# Altium schematic sheet CURRENT_SENSE.SchDoc
size A; SheetNumber: 3; SheetTotal: 9
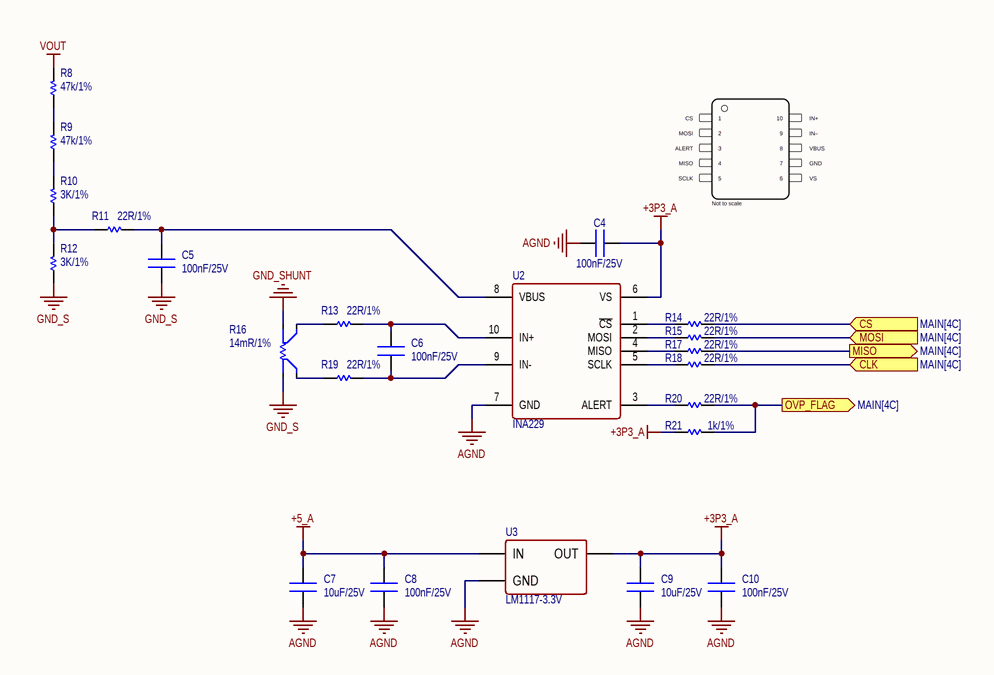
[diagram p0: CURRENT_SENSE.SchDoc]

## Parts
C4  100nF/25V  [CN-SMD-0603]
C5  100nF/25V  [CN-SMD-0603]
C6  100nF/25V  [CN-SMD-0603]
C7  10uF/25V  [CN-SMD-0603]
C8  100nF/25V  [CN-SMD-0603]
C9  10uF/25V  [CN-SMD-0603]
C10  100nF/25V  [CN-SMD-0603]
R8  47k/1%  [RES-SMD-0603]
R9  47k/1%  [RES-SMD-0603]
R10  3K/1%  [RES-SMD-0603]
R11  22R/1%  [RES-SMD-0603]
R12  3K/1%  [RES-SMD-0603]
R13  22R/1%  [RES-SMD-0603]
R14  22R/1%  [RES-SMD-0603]
R15  22R/1%  [RES-SMD-0603]
R16  14mR/1%  [RES-SMD-2010-SHUNT]
R17  22R/1%  [RES-SMD-0603]
R18  22R/1%  [RES-SMD-0603]
R19  22R/1%  [RES-SMD-0603]
R20  22R/1%  [RES-SMD-0603]
R21  1k/1%  [RES-SMD-0603]
U2  INA229  [VSSOP10]
U3  LM1117-3.3V  [SOT223]

## Ports
CLK (in, see MAIN[4C]), CS (in, see MAIN[4C]), MISO (out, see MAIN[4C]), MOSI (in, see MAIN[4C]), OVP_FLAG (out, see MAIN[4C])

## Nets
+3P3_A: C4.2 C9.2 C10.2 R21.2 U2.6(VS) U3.2,4(OUT)
+5_A: C7.2 C8.2 U3.3(IN)
AGND: C4.1 C7.1 C8.1 C9.1 C10.1 U2.7(GND) U3.1(GND)
GND_S: C5.1 R12.1 R16.2
GND_SHUNT: R16.1
VOUT: R8.2
CLK: R18.2 ; port CLK
CS: R14.2 ; port CS
MISO: R17.2 ; port MISO
MOSI: R15.2 ; port MOSI
OVP_FLAG: R20.2 R21.1 ; port OVP_FLAG
NetC5_2: C5.2 R11.2 U2.8(VBUS)
NetC6_1: C6.1 R19.2 U2.9(IN-)
NetC6_2: C6.2 R13.2 U2.10(IN+)
NetR8_1: R8.1 R9.2
NetR9_1: R9.1 R10.2
NetR10_1: R10.1 R11.1 R12.2
NetR13_1: R13.1 R16.3(V)
NetR14_1: R14.1 U2.1(~{CS})
NetR15_1: R15.1 U2.2(MOSI)
NetR16_4: R16.4(V) R19.1
NetR17_1: R17.1 U2.4(MISO)
NetR18_1: R18.1 U2.5(SCLK)
NetR20_1: R20.1 U2.3(ALERT)

## Library data of the parts
C4-C6 C8 C10 = CN: CL10B104KA8NNNC; PN: CL10B104KA8NNNC
C7 C9 = CN: 0603W106M250XD; PN: 0603W106M250XD
R8 R9 = Res-SMD: ERJ-3EKF4702V; Manufacturer: Generic Components; Class: Passive; PN: ERJ-3EKF4702V; Publisher: Altium Hobart Technology Centre
R10 R12 = Res-SMD: ERA-3AEB302V; Manufacturer: Generic Components; Class: Passive; PN: ERA-3AEB302V; Publisher: Altium Hobart Technology Centre
R11 R13-R15 R17-R20 = Res-SMD: ERJ-3EKF22R0V; Manufacturer: Generic Components; Class: Passive; PN: ERJ-3EKF22R0V; Publisher: Altium Hobart Technology Centre
R16 = Res-SMD-SHUNT: MSMA2010R0140FDM; Manufacturer: Generic Components; Class: Passive; PN: MSMA2010R0140FDM; Publisher: Altium Hobart Technology Centre
R21 = Res-SMD: ERJ-3EKF1001V; Manufacturer: Generic Components; Class: Passive; PN: ERJ-3EKF1001V; Publisher: Altium Hobart Technology Centre
U2 = INA229: INA229 85-V, 20-Bit, Ultra-Precise Power/Energy/Charge Monitor With SPI Interface; PN: INA229AIDGSR
U3 = LM1117: TLV1117-33IDCYR; PN: TLV1117-33IDCYR; Website: http://group3i.net